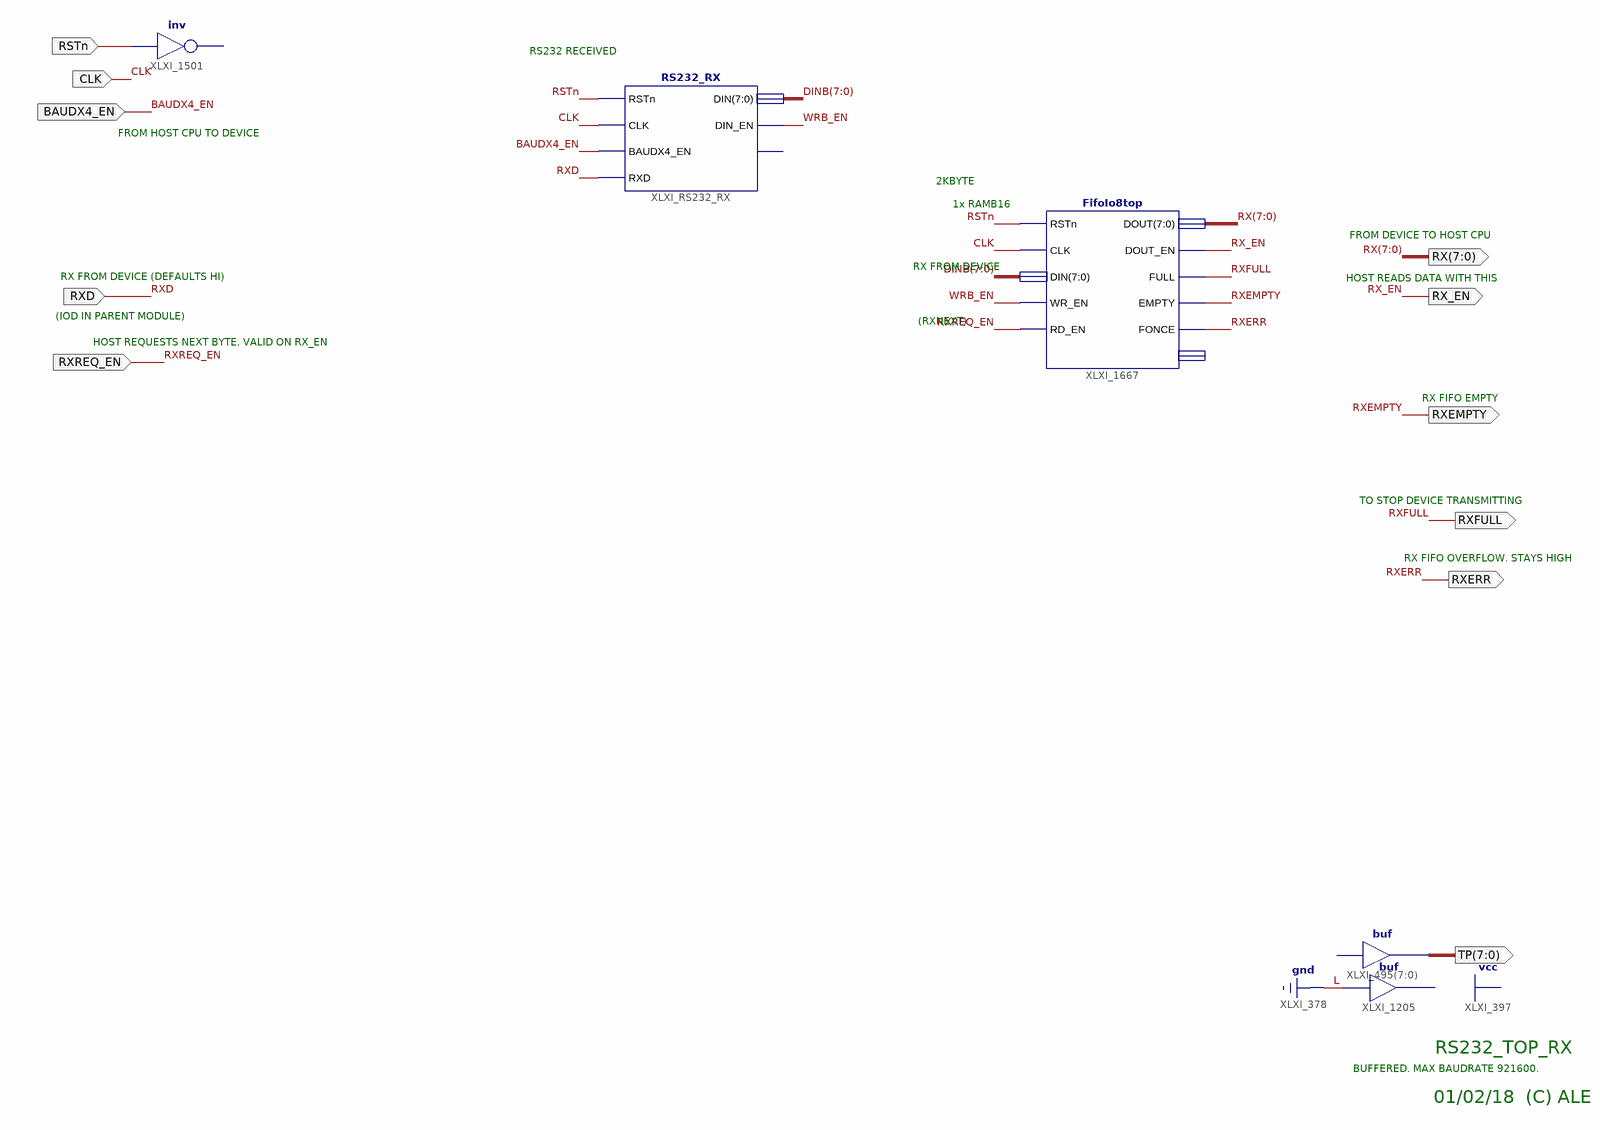
[diagram p0: schematic sheet 1]
// Xilinx ISE schematic RS232_TOP_RX.sch (zynq) as structural Verilog: 5 symbols, 11 ports
module RS232_TOP_RX (
  input  CLK,
  input  RSTn,
  input  RXD,
  input  RXREQ_EN,
  input  BAUDX4_EN,
  output RXEMPTY,
  output [7:0] RX,
  output RX_EN,
  output RXERR,
  output RXFULL,
  output [7:0] TP
);

  wire WRB_EN;
  wire [7:0] DINB;

  // inv XLXI_1501 has open pins: I=RSTn, O=open
  RS232_RX XLXI_RS232_RX (
    .BAUDX4_EN(BAUDX4_EN), .CLK(CLK), .DIN(DINB), .DIN_EN(WRB_EN), .RSTn(RSTn), .RXD(RXD));  // open: INHIBIT
  // buf XLXI_495[7..0] has open pins: I=open, O=TP
  // buf XLXI_1205 has open pins: I=1'b0, O=open
  FifoIo8top XLXI_1667 (
    .CLK(CLK), .DIN(DINB), .DOUT(RX), .DOUT_EN(RX_EN), .EMPTY(RXEMPTY), .FONCE(RXERR), .FULL(RXFULL),
    .RD_EN(RXREQ_EN), .RSTn(RSTn), .WR_EN(WRB_EN));  // open: TP

  // Notes on the sheet:
  //   RS232 RECEIVED
  //   FROM HOST CPU TO DEVICE
  //   2KBYTE
  //   1x RAMB16
  //   FROM DEVICE TO HOST CPU
  //   RX FROM DEVICE
  //   RX FROM DEVICE (DEFAULTS HI)
  //   HOST READS DATA WITH THIS
  //   (IOD IN PARENT MODULE)
  //   (RXNEXT)
  //   HOST REQUESTS NEXT BYTE. VALID ON RX_EN
  //   RX FIFO EMPTY
  //   TO STOP DEVICE TRANSMITTING
  //   RX FIFO OVERFLOW. STAYS HIGH
  //   RS232_TOP_RX
  //   BUFFERED. MAX BAUDRATE 921600.
  //   01/02/18  (C) ALE
endmodule
